# Altium project LPF.PrjPcb
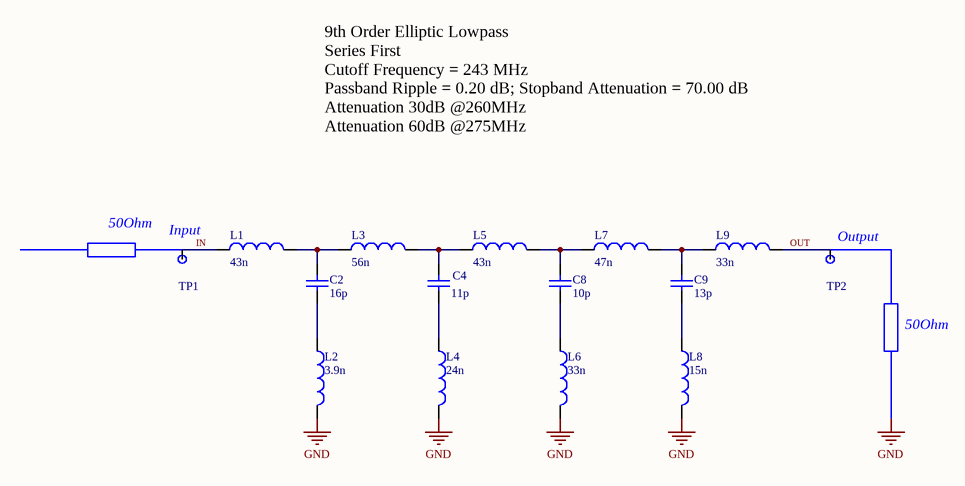
[diagram p0: Filter_240MHz.SchDoc]
1 sheet, 15 parts. Net scope: global (net labels, ports and power ports of the same name join across sheets).
Board file: LPF.PcbDoc

## Sheet Filter_240MHz.SchDoc: 9th Order Elliptic Lowpass Filter
size A3; Organization: Abilita Ltd; Address1: 9/36 Adar St; Address2: Ashdod; Address3: Israel; Address4: 7775229; DocumentNumber: ED Filter; Revision: 0; SheetNumber: 1; SheetTotal: 1

### Parts
C2  16p  [C0402]
C4  11p  [C0402]
C8  10p  [C0402]
C9  13p  [C0402]
L1  43n  [R0402]
L2  3.9n  [R0402]
L3  56n  [R0402]
L4  24n  [R0402]
L5  43n  [R0402]
L6  33n  [R0402]
L7  47n  [R0402]
L8  15n  [R0402]
L9  33n  [R0402]
TP1  TP1mm  [TP1mm]  (value not drawn)  (no BOM)
TP2  TP1mm  [TP1mm]  (value not drawn)  (no BOM)

### Nets
GND: L2.2 L4.2 L6.2 L8.2
IN: L1.1 TP1.1
OUT: L9.2 TP2.1
NetC2_1: C2.1 L1.2 L3.1
NetC2_2: C2.2 L2.1
NetC4_1: C4.1 L3.2 L5.1
NetC4_2: C4.2 L4.1
NetC8_1: C8.1 L5.2 L7.1
NetC8_2: C8.2 L6.1
NetC9_1: C9.1 L7.2 L9.1
NetC9_2: C9.2 L8.1

### Notes on the sheet
- 9th Order Elliptic Lowpass
  Series First
  Cutoff Frequency = 243 MHz
  Passband Ripple = 0.20 dB; Stopband Attenuation = 70.00 dB
  Attenuation 30dB @260MHz
  Attenuation 60dB @275MHz
- (near TP1) 50Ohm
- Input
- (near TP2) Output
- 50Ohm
- Labels drawn without touching a wire or pin: GND
- Title
- Size:
- Date:
- A3
- Number:
- Time:
- Sheet
- Revision:
- of
- File:

### Library data of the parts
C2 = 1n_50V_0402: 16p 50V 0402; Part Number: CQ0402FRNPO9BN160; Voltage: 50V
C4 = 1n_50V_0402: 11p 50V 0402; Part Number: CC0402JRNPO9BN110; Voltage: 50V
C8 = 1n_50V_0402: 10p 50V 0402; Part Number: CQ0402FRNPO9BN100; Voltage: 50V
C9 = 1n_50V_0402: 13p 50V 0402; Part Number: CC0402JRNPO9BN130; Voltage: 50V
L1 L5 = 0402HC-3N9ECTS: 43n 0402 0.7Ohm; Part Number: 0402HM-430EGTS; R: 700m
L2 = 0402HC-3N9ECTS: 3.9n 0402; R: 40m; Part Number: 0402HC-3N9ECTS
L3 = 0402HC-3N9ECTS: 56n 0402 1.17Ohm; Part Number: 0402HM-560EGTS; R: 1.17Ohm
L4 = 0402HC-3N9ECTS: 24n 0402 0.53Ohm; Part Number: LQW15AN24NJ00D; R: 520m
L6 L9 = 0402HC-3N9ECTS: 33n 0402 0.63Ohm; Part Number: LQW15AN33NJ00D; R: 630m
L7 = 0402HC-3N9ECTS: 47n 0402 0.72Ohm; Part Number: LQG15HS47NJ02D; R: 0.72
L8 = 0402HC-3N9ECTS: 15n 0402 0.16Ohm; Part Number: LQW15AN15NG00D; R: 40m